# EAGLE design MM-H_rev1 (EAGLE 8.7.1)
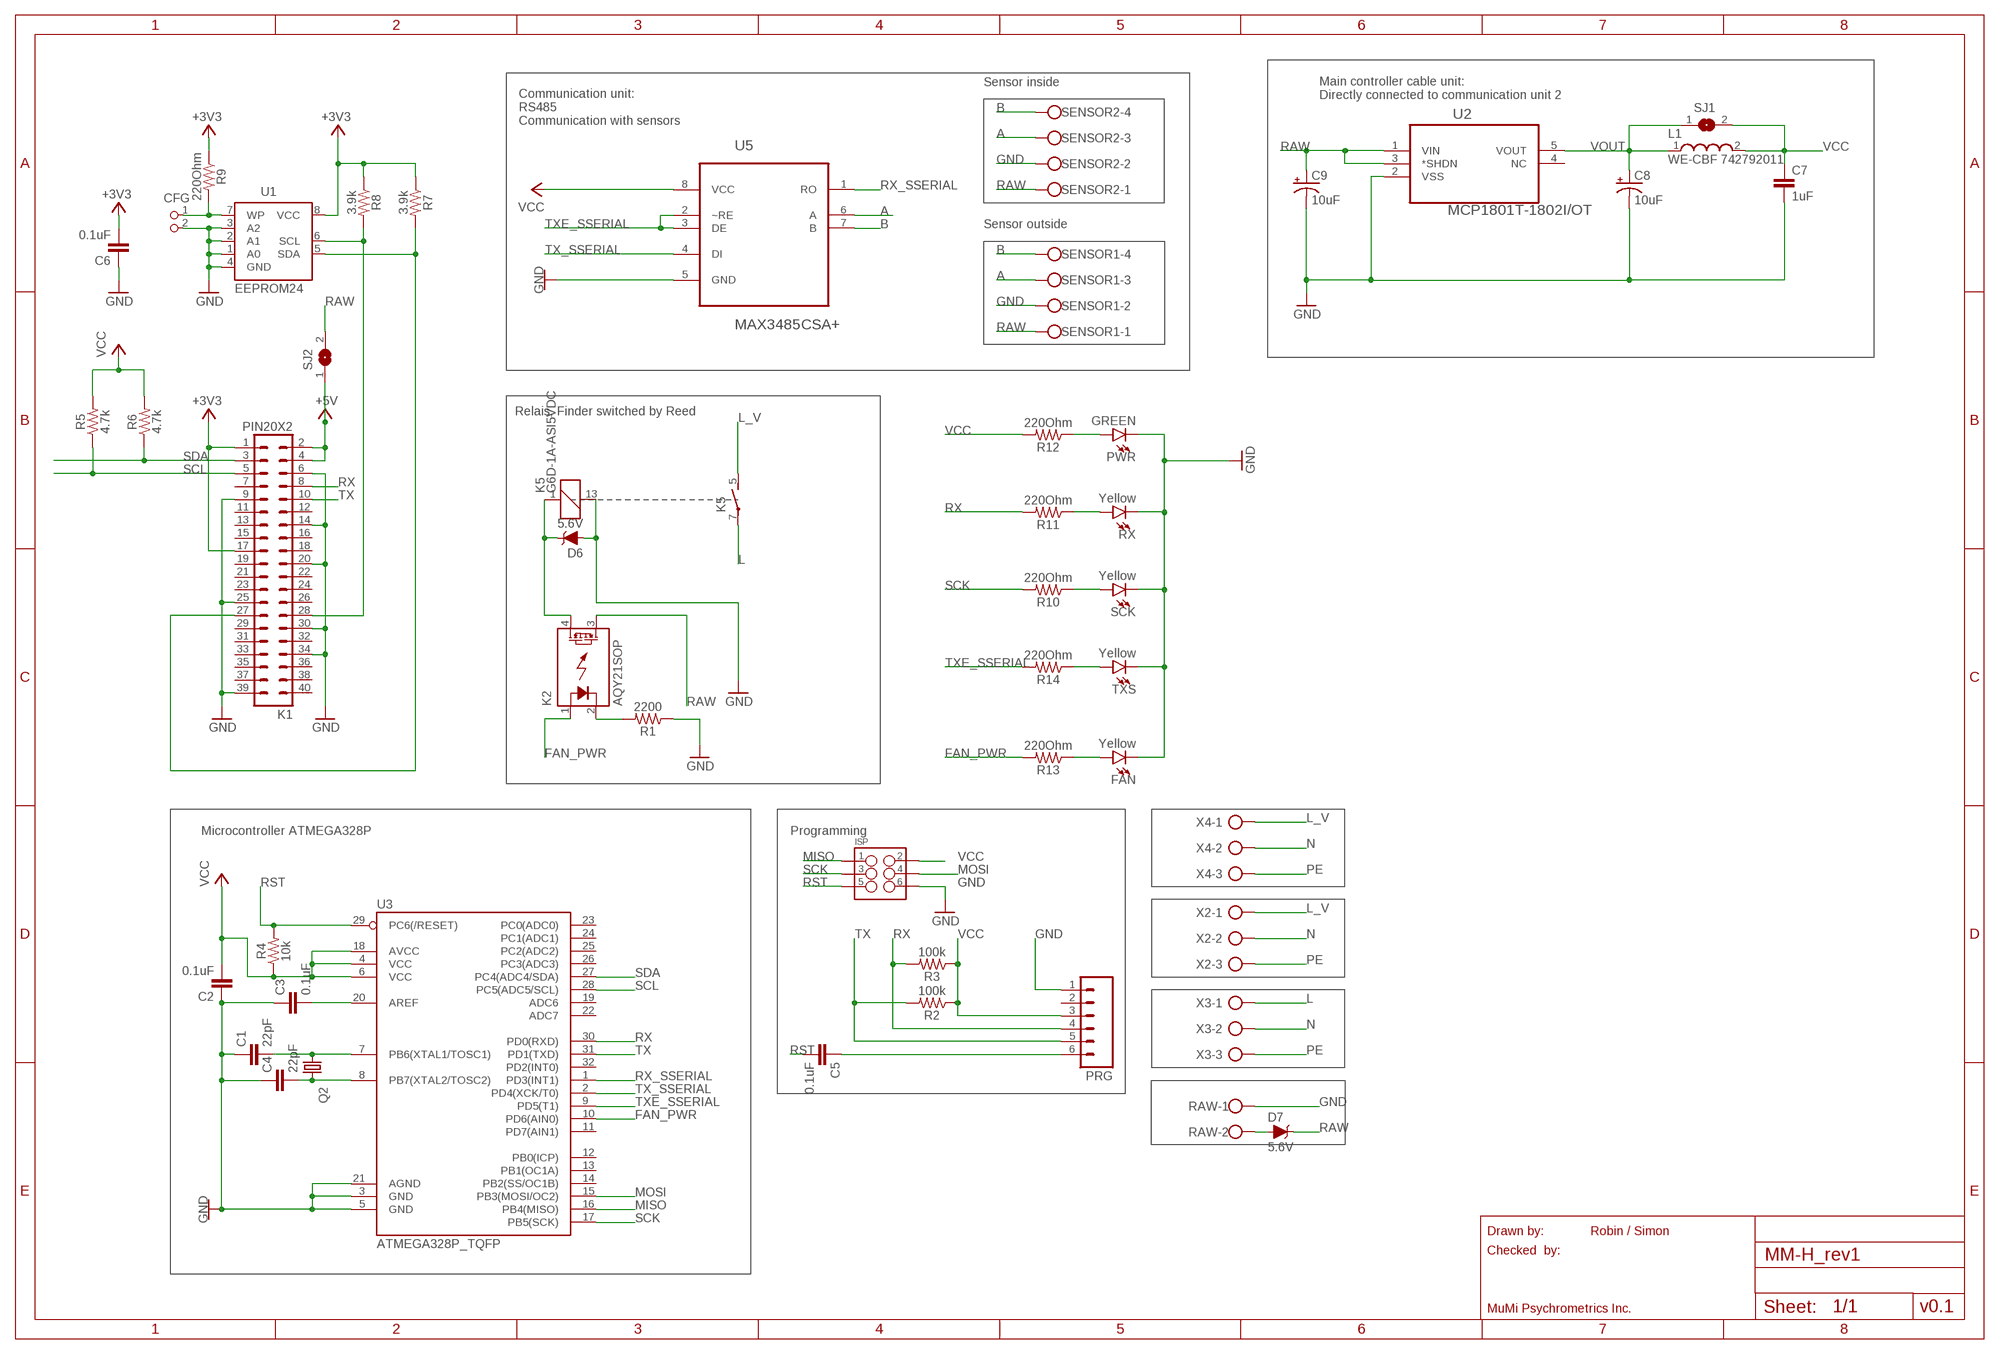
[diagram p0: schematic, sheet 1]

## Parts
C1  22pF  0.1UF-0402-16V-10%  [0402]
C2  0.1uF  0.1UF-0402-16V-10%  [0402]
C3  0.1uF  0.1UF-0402-16V-10%  [0402]
C4  22pF  0.1UF-0402-16V-10%  [0402]
C5  0.1uF  0.1UF-0402-16V-10%  [0402]
C6  0.1uF  0.1UF-0402-16V-10%  [0402]
C7  1uF  0.1UF-0402-16V-10%  [0402]
C8  10uF  CAP_POL1206  [EIA3216]
C9  10uF  CAP_POL1206  [EIA3216]
CFG  PIN2_100  [PIN_W_2]
D6  5.6V  DIODE-ZENER-MMSZ5232BS  [SOD-323]
D7  5.6V  DIODE-ZENER-MMSZ5232BS  [SOD-323]
FAN  Yellow  LED-YELLOW0603-SMART  [LED-0603]
ISP  M03X2POGO_PINS  [2X3_POGO]
K1  PIN20X2  [PIN_20X2]
K2  AQY21SOP  [SOP04]
K5  G6D-1A-ASI5VDC  [G6D]
L1  WE-CBF 742792011  WE-CBF_0805(WB/HS)  [WE-CBF_0805(W=3.0)]
PRG  M06SILK_FEMALE_PTH  [1X06]
PWR  GREEN  LED-GREEN0603  [LED-0603]
Q2  KX-K  [11.4X4.5]
R1  2200  RESISTOR0402  [0402]
R2  100k  RESISTOR0402  [0402]
R3  100k  RESISTOR0402  [0402]
R4  10k  RESISTOR0402  [0402]
R5  4.7k  RESISTOR0402  [0402]
R6  4.7k  RESISTOR0402  [0402]
R7  3.9k  RESISTOR0402  [0402]
R8  3.9k  RESISTOR0402  [0402]
R9  220Ohm  RESISTOR0402  [0402]
R10  220Ohm  RESISTOR0402  [0402]
R11  220Ohm  RESISTOR0402  [0402]
R12  220Ohm  RESISTOR0402  [0402]
R13  220Ohm  RESISTOR0402  [0402]
R14  220Ohm  RESISTOR0402  [0402]
RAW  W237-102  [W237-102]
RX  Yellow  LED-YELLOW0603-SMART  [LED-0603]
SCK  Yellow  LED-YELLOW0603-SMART  [LED-0603]
SENSOR1  W237-4  [W237-4]
SENSOR2  W237-4  [W237-4]
SJ1  SJ  [SJ]
SJ2  SJ  [SJ]
TXS  Yellow  LED-YELLOW0603-SMART  [LED-0603]
U1  EEPROM24  [SOIC8]
U2  MCP1801T-1802I/OT  [SOT95P270X145-5N]
U3  ATMEGA328P_TQFP  [TQFP32-08]
U5  MAX3485CSA+  [SOIC127P600X175-8N]
X2  AK500/3  [AK500/3]
X3  AK500/3  [AK500/3]
X4  AK500/3  [AK500/3]

## Nets
+3V3: C6.2 K1.1 K1.17 R7.1 R8.1 R9.1 U1.8(VCC)
+5V: K1.2 K1.4 SJ2.1
A: SENSOR1.3 SENSOR2.3 U5.6(A)
B: SENSOR1.4 SENSOR2.4 U5.7(B)
FAN_PWR: K2.1(A) R13.2 U3.10(PD6(AIN0))
GND: C1.1 C2.1 C3.1 C4.1 C6.1 C7.2 C8.C(-) C9.C(-) CFG.2 D6.A FAN.C ISP.P$6 K1.6 K1.9 K1.14 K1.20 K1.25 K1.30 K1.34 K1.39 K5.13 PRG.1 PWR.C R1.1 RAW.1 RX.C SCK.C SENSOR1.2 SENSOR2.2 TXS.C U1.1(A0) U1.2(A1) U1.3(A2) U1.4(GND) U2.2(VSS) U3.3(GND) U3.5(GND) U3.21(AGND) U5.5(GND)
L: K5.7(2:P) X3.1
L_V: K5.5(2:S) X2.1 X4.1
MISO: ISP.P$1 U3.16(PB4(MISO))
MOSI: ISP.P$4 U3.15(PB3(MOSI/OC2))
N: X2.2 X3.2 X4.2
N$1: K1.28 R8.2 U1.6(SCL)
N$2: K1.27 R7.2 U1.5(SDA)
N$3: CFG.1 R9.2 U1.7(WP)
N$4: K2.2(K) R1.2
N$5: C5.1 PRG.6
N$6: R11.1 RX.A
N$7: D7.A RAW.2
N$11: D6.C K2.4(DS1) K5.1
N$12: C3.2 U3.20(AREF)
N$13: PWR.A R12.1
N$14: R10.1 SCK.A
N$15: R14.1 TXS.A
N$16: FAN.A R13.1
N$17: C1.2 Q2.1 U3.7(PB6(XTAL1/TOSC1))
N$18: C4.2 Q2.2 U3.8(PB7(XTAL2/TOSC2))
PE: X2.3 X3.3 X4.3
RAW: C9.A(+) D7.C K2.3(DS2) SENSOR1.1 SENSOR2.1 SJ2.2 U2.1(VIN) U2.3(*SHDN)
RST: C5.2 ISP.P$5 R4.2 U3.29(PC6(/RESET))
RX: K1.8 PRG.4 R3.2 R11.2 U3.30(PD0(RXD))
RX_SSERIAL: U3.1(PD3(INT1)) U5.1(RO)
SCK: ISP.P$3 R10.2 U3.17(PB5(SCK))
SCL: K1.5 R5.1 U3.28(PC5(ADC5/SCL))
SDA: K1.3 R6.1 U3.27(PC4(ADC4/SDA))
TX: K1.10 PRG.5 R2.2 U3.31(PD1(TXD))
TX_SSERIAL: U3.2(PD4(XCK/T0)) U5.4(DI)
TXE_SSERIAL: R14.2 U3.9(PD5(T1)) U5.2(~RE) U5.3(DE)
VCC: C2.2 C7.1 ISP.P$2 L1.2 PRG.3 R2.1 R3.1 R4.1 R5.2 R6.2 R12.2 SJ1.2 U3.4(VCC) U3.6(VCC) U3.18(AVCC) U5.8(VCC)
VOUT: C8.A(+) L1.1 SJ1.1 U2.5(VOUT)
Unconnected: K1.7 K1.11 K1.12 K1.13 K1.15 K1.16 K1.18 K1.19 K1.21 K1.22 K1.23 K1.24 K1.26 K1.29 K1.31 K1.32 K1.33 K1.35 K1.36 K1.37 K1.38 K1.40 PRG.2 U2.4(NC) U3.11(PD7(AIN1)) U3.12(PB0(ICP)) U3.13(PB1(OC1A)) U3.14(PB2(SS/OC1B)) U3.19(ADC6) U3.22(ADC7) U3.23(PC0(ADC0)) U3.24(PC1(ADC1)) U3.25(PC2(ADC2)) U3.26(PC3(ADC3)) U3.32(PD2(INT0))

## Notes on the sheet
- Sensor inside
- Main controller cable unit:
  Directly connected to communication unit 2
- Communication unit:
  RS485
  Communication with sensors
- Sensor outside
- Relais, Finder switched by Reed
- Microcontroller ATMEGA328P | Programming
- Drawn by: | Robin / Simon
- Checked  by:
- MuMi Psychrometrics Inc. | v0.1

## Library data of the parts
C1 C4 C7 = SparkFun-Capacitors:0.1UF: 0.1µF ceramic capacitors A capacitor is a passive two-terminal electrical component used to store electrical energy temporarily in an electric field.; PROD_ID: CAP-12416; VALUE: 0.1uF
C2 C3 C5 C6 = SparkFun-Capacitors:0.1UF: 0.1µF ceramic capacitors A capacitor is a passive two-terminal electrical component used to store electrical energy temporarily in an electric field.; PROD_ID: CAP-12416
C8 C9 = SparkFun-Passives:CAP_POL: Capacitor Polarized These are standard SMD and PTH capacitors. Normally 10uF, 47uF, and 100uF in electrolytic and tantalum varieties. Always verify the external diameter of the through hole cap, it varies with capacity, voltage, and manufacturer. The EIA devices should be standard.
CFG = FLYFISH:PIN2
D6 D7 = SparkFun-DiscreteSemi:DIODE-ZENER: Zener Diode A Zener diode allows current to flow from its anode to its cathode like a normal semiconductor diode, but it also permits current to flow in the reverse direction when its "Zener voltage" is reached. - WIkipedia; PROD_ID: DIO-12442
FAN RX SCK TXS = SparkFun-LED:LED-YELLOW: Yellow SMD LED Used in manufacturing several products at SparkFun. Packages: 0603 - SMD 0603 package[Product Link] <http://www.kingbrightusa.com/product.asp?catalog_name=LED&product_id=APT1608SYCK> 0603 -SMART - SMART SMD 0603 package (more efficient/more expensive) [Product Link] <http://www.osram-os.com/osram_os/en/products/product-catalog/led-light-emitting-diodes/smartled-0603/ly-l29k/index.jsp> LilyPad - SMD1206 package[Product Datasheet] <https://www.sparkfun.com/datasheets/DevTools/LilyPad/Q150YUS4.pdf> SparkFun Products: Blynk Board <https://www.sparkfun.com/products/13794> IOIO-OTG <https://www.sparkfun.com/products/13613> XBee Explorer Serial <https://www.sparkfun.com/products/13225>; PROD_ID: DIO-11230
ISP = SparkFun-Connectors:M03X2: 2x3 .1" header. Shrouded, with keying- CONN-10681 SMT- CONN-11415 Pogo pins- HW-11044; PROD_ID: HW-11044
K1 = FLYFISH:PIN20X2
K2 = relay:AQY*: PhotoMOS Relay NAiS Source: http://www.panasonic-electric-works.com/catalogues/downloads/photomos/ds_x615_en_aqz10_20.pdf; OC_FARNELL: unknown; OC_NEWARK: unknown
K5 = relay:G6D?*: OMRON Slim, Miniature PCB Relay 17.5 × 6.5 × 12.5 mm with Socked Source: http://ecb.omron.com.sg/pdf/relay/power/G6D.pdf; OC_FARNELL: 9812660; OC_NEWARK: unknown
L1 = Wurth_Elektronik_Passive_rev15f:WE-CBF: WE-CBF SMD EMI Suppression Ferrite Bead Characteristics Reliable Ni-Sn electrodes High rated current up to 6 A Operating temperature: –55 ºC to +125 ºC Applications Perfect as data lined filter and for uncoupling of distribution voltage Variant abbreviation WB means WIDE BAND HS means HIGH SPEED HC means HIGH CURRENT <http://katalog.we-online.de/media/images/eisos/FeCBF_pf2.jpg> Details see: http://katalog.we-online.de/en/pbs/WE-CBF Updated on 2014-06-19 2014 (C) Wurth Elektronik
PRG = SparkFun-Connectors:M06: Header 6 Standard 6-pin 0.1" header. Use with straight break away headers (SKU : PRT-00116), right angle break away headers (PRT-00553), swiss pins (PRT-00743), machine pins (PRT-00117), and female headers (PRT-00115). Molex polarized connector foot print use with SKU : PRT-08094 with associated crimp pins and housings. NOTES ON THE VARIANTS LOCK and LOCK_LONGPADS... This footprint was designed to help hold the alignment of a through-hole component (i.e. 6-pin header) while soldering it into place. You may notice that each hole has been shifted either up or down by 0.005 of an inch from it's more standard position (which is a perfectly straight line). This slight alteration caused the pins (the squares in the middle) to touch the edges of the holes. Because they are alternating, it causes a "brace" to hold the component in place. 0.005 has proven to be the perfect amount of "off-center" position when using our standard breakaway headers. Although looks a little odd when you look at the bare footprint, once you have a header in there, the alteration is very hard to notice. Also,if you push a header all the way into place, it is covered up entirely on the bottom side. This idea of altering the position of holes to aid alignment will be further integrated into the Sparkfun Library for other footprints. It can help hold any component with 3 or more connection pins.; PROD_ID: CONN-08437
PWR = SparkFun-LED:LED-GREEN: Green SMD LED Used in manufacturing of various products at SparkFun Packages: 0603 - SMD 0603 package [Product Link] <http://www.futureelectronics.com/en/technologies/semiconductors/optoelectronics/leds/Pages/9894312-LTST-C190GKT.aspx?CrossPart=HSMG-C190&IM=0> LilyPad 1206 - SMD1206 LilyPad package [Product Link] <http://www.futureelectronics.com/en/Technologies/Product.aspx?ProductID=IN150NGHARVATEKCORPORATION2049943&IM=0> 1206 - SMD1206 package [Product Link] <http://www.futureelectronics.com/en/technologies/semiconductors/optoelectronics/leds/Pages/8315665-LTST-C150KGKT.aspx?IM=0> 1206 Bottom Mount -SMD 1206 Bottom Mount [Product Link] <http://www.digikey.com/product-detail/en/lite-on-inc/LTST-C230KGKT/160-1456-1-ND/386854> SparkFun Products: Pro Mini 328 -5V <https://www.sparkfun.com/products/821> RedBoard <https://www.sparkfun.com/products/12757> MP3 Trigger <https://www.sparkfun.com/products/13720> Makey Makey <https://www.sparkfun.com/products/11076>; PROD_ID: DIO-00821
Q2 = crystal-geyer_V1_0:KX: Quartz Crystals (MHz) SMD: KX - Serie Model Size l/w/h [mm] Frequency Range Frequency Stability Temp. Range [°C] Load Capacitance AECQ 200 availabel Datasheet KX-4 KX-5 KX-6 KX-7 KX-9A KX-9B KX-12A KX-12B KX-13 KX-20 KX-K KX-KS 1.6/1.2/0.3 2.0/1.6/0.45 2.5/2.0/0.55 3.2/2.5/0.8 5.0/3.2/1.0 5.0/3.2/1.1 6.0/3.5/1.1 6.0/3.5/1.0 7.0/5.0 /1.3 11.6/5.5/1.6 12.3/4.5/4.2 12.3/4.5/3.2 24.0 ~ 80.0 MHz 16.0 ~ 80.0 MHz 12.0 ~ 80.0 MHz 8.0 ~ 60.0 MHz 7,68 ~ 300,0 MHz 8,0 ~ 50,0 MHz 8,0 ~ 150,0 MHz 8,0 ~ 50,0 MHz 6,0 ~ 160,0 MHz 3,579 ~ 25,0 MHz 3,579 ~ 70,0 MHz 3,579 ~ 70,0 MHz ±10 … ±50ppm ±10 … ±50ppm ±10 … ±50ppm ±10 … ±50ppm ±10 … ±50ppm ±10 … ±50ppm ±10 … ±50ppm ±10 … ±50ppm ±10 … ±50ppm ±50ppm ±10 … ±50ppm ±10 … ±50ppm (*) -40°C …+85°C (*) -40°C …+125°C (*) -40°C …+125°C (*) -40°C …+125°C (*) -40°C …+105°C (*) -40°C …+105°C (*) -40°C …+125°C (*) -40°C …+105°C (*) -40°C …+105°C (*) -40°C …+105°C (*) -40°C …+85°C (*) -40°C …+85°C 8, 8…16 8, 8…16 10, 8…16 12, 7…20 16, 10…20 16, 10…20 16, 10…20 16, 12…20 16, 12…20 16, 12…20 16, 12…30 16, 12…30 - yes yes yes - - - - - - - - KX-4.pdf <http://www.geyer-electronic.de/uploads/tx_userartikelfrequenz/GEYER-KX-4.pdf> KX-5.pdf <http://www.geyer-electronic.de/uploads/tx_userartikelfrequenz/GEYER-KX-5.pdf> KX-6.pdf <http://www.geyer-electronic.de/uploads/tx_userartikelfrequenz/GEYER-KX-6.pdf> KX-7.pdf <http://www.geyer-electronic.de/uploads/tx_userartikelfrequenz/GEYER-KX-7.pdf> KX-9A.pdf <http://www.geyer-electronic.de/uploads/tx_userartikelfrequenz/GEYER-KX-9A.pdf> KX-9B.pdf <http://www.geyer-electronic.de/uploads/tx_userartikelfrequenz/GEYER-KX-9B.pdf> KX-12A.pdf <http://www.geyer-electronic.de/uploads/tx_userartikelfrequenz/GEYER-KX-12A.pdf> KX-12B.pdf <http://www.geyer-electronic.de/uploads/tx_userartikelfrequenz/GEYER-KX-12B.pdf> KX-13.pdf <http://www.geyer-electronic.de/uploads/tx_userartikelfrequenz/GEYER-KX-13.pdf> KX-20.pdf <http://www.geyer-electronic.de/uploads/tx_userartikelfrequenz/GEYER-KX-20.pdf> KX-K.pdf <http://www.geyer-electronic.de/uploads/tx_userartikelfrequenz/GEYER-KX-K.pdf> KX-KS.pdf <http://www.geyer-electronic.de/uploads/tx_userartikelfrequenz/GEYER-KX-KS.pdf> <http://www.geyer-electronic.de/fileadmin/template/img/logo-geyer-electronic.png> Details see: http://www.geyer-electronic.de/Frequenz-Produkte.9.0.html Created 2016-06-07, Hans Locher 2016 (C) Geyer Quartz Technology KX4,KX5,KX6,KX7,KX9A,KX9B,KX12A,KX12B,KX13,KX20,KXK,KXKS;1612;2016;2520;3225;5032;6035;7050;11655;12345;1,6x1,2;2,0x1,6;2,5x2,0;3,2x2,5;5,0x3,2;6,0x3,5;7,0x5,0;11,6x5,5;12,3x4,5;12,3x4,5;1.6x1.2;2.0x1.6;2.5x2.0;3.2x2.5;5.0x3.2;6.0x3.5;7.0x5.0;11.6x5.5;12.3x4.5;12.3x4.5;
R1-R14 = SparkFun-Resistors:RESISTOR: Generic Resistor Package
RAW = con-wago-500:W237-102: WAGO SCREW CLAMP; MPN: 237-102; OC_FARNELL: unknown; OC_NEWARK: 70K9898
SENSOR1 SENSOR2 = con-wago-500:W237-4: WAGO SCREW CLAMP; OC_FARNELL: unknown; OC_NEWARK: unknown
SJ1 SJ2 = jumper:SJ: SMD solder JUMPER
U1 = FLYFISH:EEPROM24
U2 = Microchip_By_element14_Batch_1:MCP1801T-1802I/OT: IC, LDO, 1.8V, 150MA, SOT-23-5; MPN: MCP1801T-1802I/OT; OC_FARNELL: 1578368; OC_NEWARK: 54M4827; PACKAGE: SOT-23-5; SUPPLIER: MICROCHIP
U3 = SparkFun-IC-Microcontroller:ATMEGA328P_TQFP: Popular 328P in QFP Storefront component: ATmega328 - TQFP <https://www.sparkfun.com/products/13448> (COM-13448) Datasheet <http://www.sparkfun.com/datasheets/Components/SMD/ATMega328.pdf> SparkFun Products SparkFun RedBoard - Programmed with Arduino <https://www.sparkfun.com/products/12757> (DEV-12757) Arduino Pro Mini 328 - 5V/16MHz <https://www.sparkfun.com/products/11113> (DEV-11113) Arduino Pro Mini 328 - 3.3V/8MHz <https://www.sparkfun.com/products/11114> (DEV-11114) SparkFun OpenLog <https://www.sparkfun.com/products/13712> (DEV-13712) SparkFun MicroView - OLED Arduino Module <https://www.sparkfun.com/products/12923> (DEV-12923) SparkFun Digital Sandbox <https://www.sparkfun.com/products/12651> (DEV-12651) SparkFun PicoBoard <https://www.sparkfun.com/products/11888> (WIG-11888) Arduino Fio <https://www.sparkfun.com/products/10116> (DEV-10116) LilyPad Arduino 328 Main Board <https://www.sparkfun.com/products/13342> (DEV-13342) SparkFun RedStick <https://www.sparkfun.com/products/13741> (DEV-13741) LilyPad MP3 <https://www.sparkfun.com/products/11013> (DEV-11013) LilyPad Arduino SimpleSnap <https://www.sparkfun.com/products/10941> (DEV-10941) SparkFun Stepoko <https://www.sparkfun.com/products/13899> (ROB-13899) SparkFun Geiger Counter <https://www.sparkfun.com/products/11345> (SEN-11345) SparkFun EL Sequencer <https://www.sparkfun.com/products/12781> (COM-12781) Arduino Pro 328 - 5V/16MHz <https://www.sparkfun.com/products/10915> (DEV-10915) CryptoCape <https://www.sparkfun.com/products/12773> (DEV-12773) SparkFun IR Thermometer Evaluation Board - MLX90614 <https://www.sparkfun.com/products/10740> (SEN-10740) SparkFun RedBot Mainboard <https://www.sparkfun.com/products/12097> (ROB-12097) Arduino Pro 328 - 3.3V/8MHz <https://www.sparkfun.com/products/10914> (DEV-10914) SparkFun Block for Intel® Edison - Arduino <https://www.sparkfun.com/products/13036> (DEV-13036) SparkFun Simon Says - Surface Mount Soldering Kit <https://www.sparkfun.com/products/10935> (KIT-10935) SparkFun 7-Segment Serial Display - Red <https://www.sparkfun.com/products/11441> (COM-11441) SparkFun 7-Segment Serial Display - White <https://www.sparkfun.com/products/11629> (COM-11629) SparkFun 7-Segment Serial Display - Yellow <https://www.sparkfun.com/products/11443> (COM-11443) SparkFun 7-Segment Serial Display - Kelly Green <https://www.sparkfun.com/products/11440> (COM-11440) SparkFun 7-Segment Serial Display - Blue <https://www.sparkfun.com/products/11442> (COM-11442) SparkFun OpenSegment Serial Display - 20mm (Blue) <https://www.sparkfun.com/products/11647> (COM-11647) SparkFun OpenSegment Serial Display - 20mm (Green) <https://www.sparkfun.com/products/11646> (COM-11646) SparkFun OpenSegment Serial Display - 20mm (White) <https://www.sparkfun.com/products/11648> (COM-11648) SparkFun OpenSegment Serial Display - 20mm (Red) <https://www.sparkfun.com/products/11644> (COM-11644) SparkFun OpenSegment Serial Display - 20mm (Yellow) <https://www.sparkfun.com/products/11645> (COM-11645) SparkFun OpenSegment Shield <https://www.sparkfun.com/products/13190> (DEV-13190); PROD_ID: IC-09069
U5 = Maxim_By_element14_Batch_1:MAX3485CSA+: 3.3V-Powered, 10Mbps and Slew-Rate-Limited True RS-485/RS-422 Transceivers; MPN: MAX3485CSA+; OC_FARNELL: 1379946; OC_NEWARK: 68K4659; PACKAGE: SOIC-8; SUPPLIER: Maxim
X2-X4 = Own:AK500/3: CONNECTOR; OC_FARNELL: unknown; OC_NEWARK: unknown

## Board
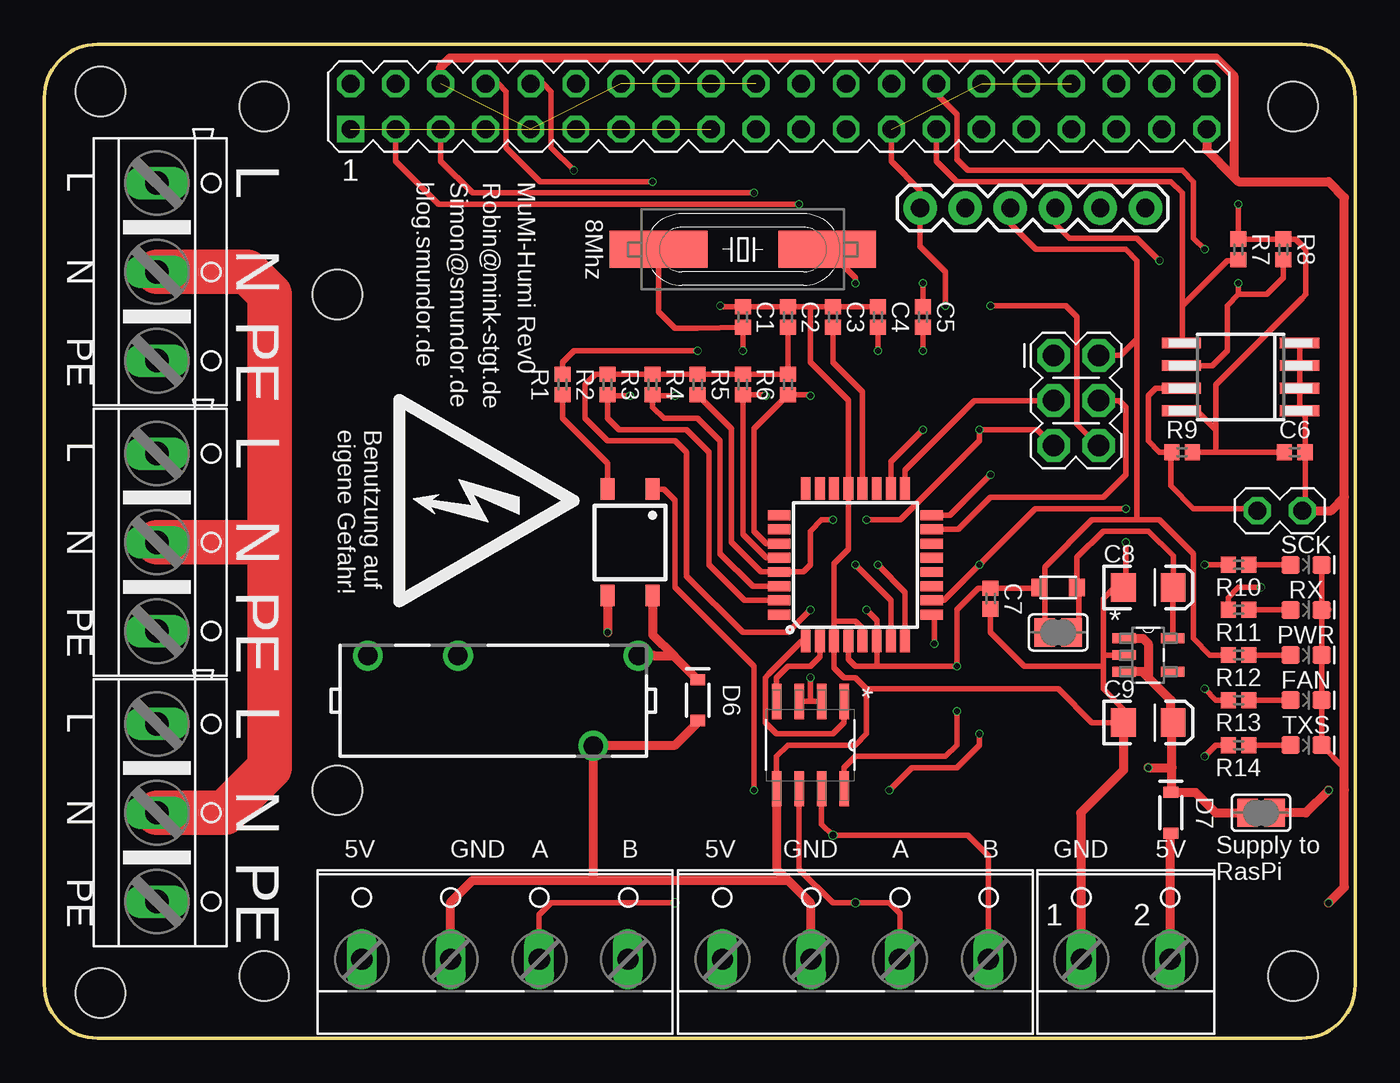
[diagram p1: board, top side]
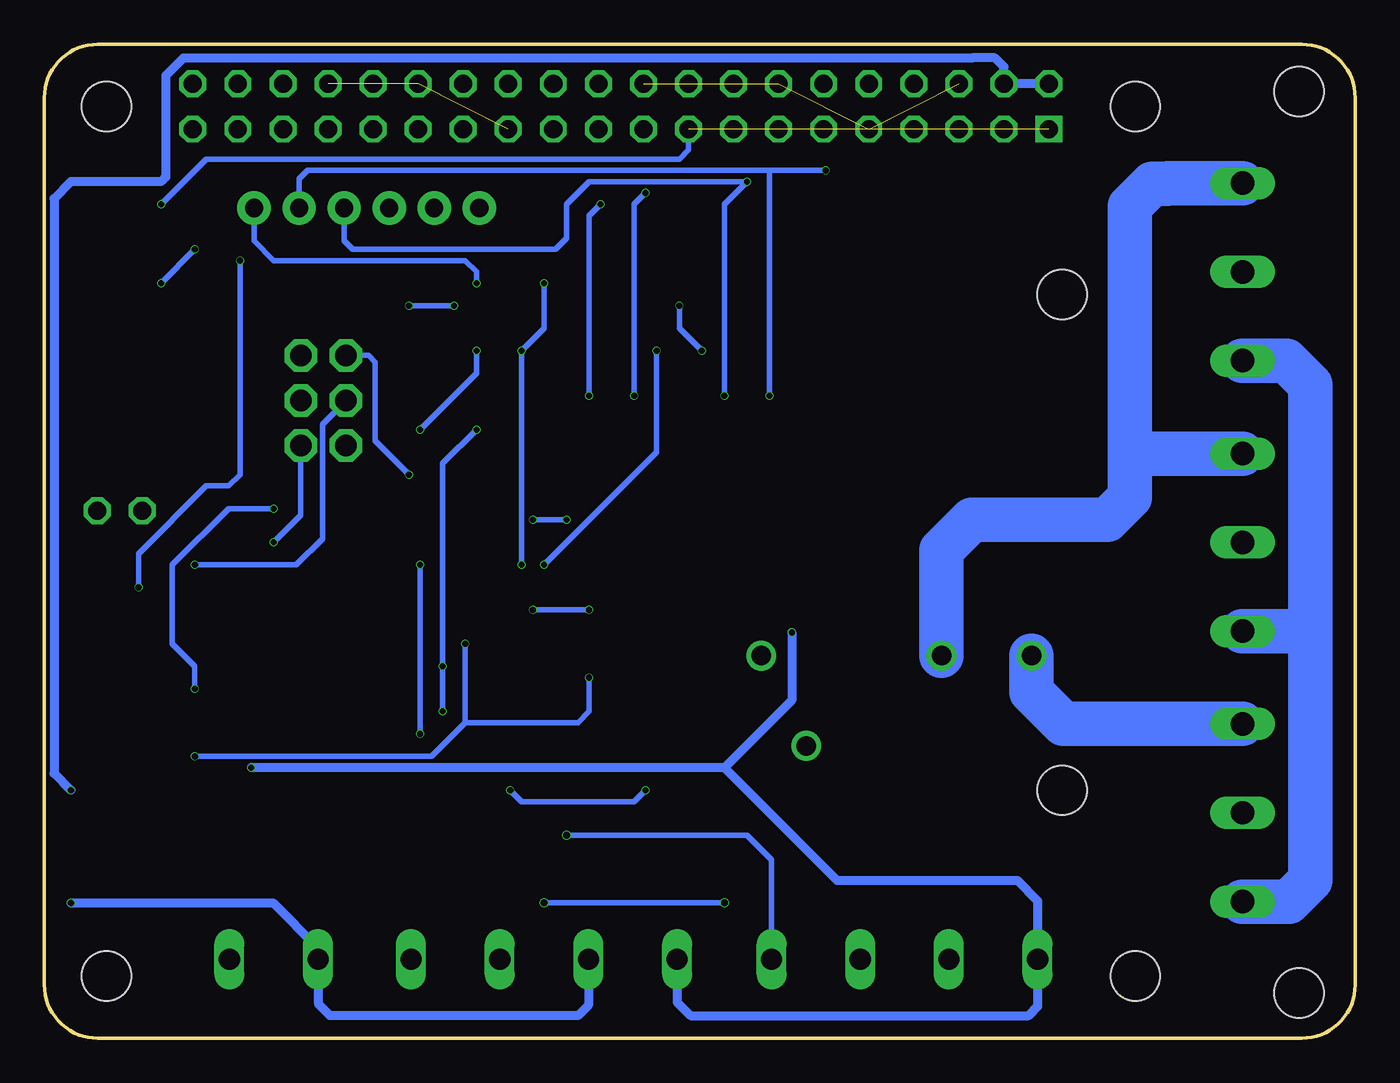
[diagram p2: board, bottom side, seen from below]

Size 73.89 x 56 mm. Coordinates in mm from the lower left corner, seen from the top.
Outline: 0,3 arc90 3,0 70.89,0 arc90 73.89,3 73.89,53 arc90 70.89,56 3,56 arc90 0,53 0,3
Copper layers (1*16): Top 0.035mm / dielectric 1.5mm / Bottom 0.035mm
Design rules "aisler_go_2layer": minimum track width 0.1mm, minimum drill 0.2mm, track to track 0.1mm, track to pad 0.1mm, pad to pad 0.1mm, via to via 0.1mm, smd to smd 0.1mm, copper to edge 0.2mm, drill to drill 0.21mm, minimum pad ring 0.25mm, minimum via ring 0.05mm, stop-mask expansion 0.01mm, vias tented up to drill 0mil, thermal gap 10mil
Holes 2.8 mm at 12.39,3.5 12.39,52.5 70.39,52.5 70.39,3.5 3.17,53.34 3.17,2.54 16.51,41.91 16.51,13.97
tRestrict: area 10.8,51 to 13.9,54; area 68.8,51 to 71.9,54; area 68.8,1.9 to 71.9,5; area 10.8,1.9 to 13.9,5
bRestrict: area 10.8,1.9 to 13.9,5; area 10.8,51 to 13.9,54; area 68.8,1.9 to 71.9,5; area 68.8,51 to 71.9,54

### Footprints (pad centres in the part's own frame; a part is rotated, then mirrored left to right if it is on the bottom)
0402 = smd 0.85 x 0.9: 1 -0.58,0; 2 0.58,0
EIA3216 = smd 1.4 x 1.6: A 1.4,0; C -1.4,0
PIN_W_2 = drill 1.016 octagon: 1 0,0; 2 0,-2.54
SOD-323 = smd 0.63 x 0.83: A 1.15,0; C -1.15,0
LED-0603 = smd 1 x 1: A -0.877,0; C 0.877,0
2X3_POGO = drill 1.2 pad 1.829 octagon: P$1 0,0; P$2 0,2.54; P$3 2.54,0; P$4 2.54,2.54; P$5 5.08,0; P$6 5.08,2.54
PIN_20X2 = drill 1.016 square: 1 -24.13,-1.27 | drill 1.016 octagon: 2 -24.13,1.27; 3 -21.59,-1.27; 4 -21.59,1.27; 5 -19.05,-1.27; 6 -19.05,1.27; 7 -16.51,-1.27; 8 -16.51,1.27; 9 -13.97,-1.27; 10 -13.97,1.27; 11 -11.43,-1.27; 12 -11.43,1.27; 13 -8.89,-1.27; 14 -8.89,1.27; 15 -6.35,-1.27; 16 -6.35,1.27; 17 -3.81,-1.27; 18 -3.81,1.27; 19 -1.27,-1.27; 20 -1.27,1.27; 21 1.27,-1.27; 22 1.27,1.27; 23 3.81,-1.27; 24 3.81,1.27; 25 6.35,-1.27; 26 6.35,1.27; 27 8.89,-1.27; 28 8.89,1.27; 29 11.43,-1.27; 30 11.43,1.27; 31 13.97,-1.27; 32 13.97,1.27; 33 16.51,-1.27; 34 16.51,1.27; 35 19.05,-1.27; 36 19.05,1.27; 37 21.59,-1.27; 38 21.59,1.27; 39 24.13,-1.27; 40 24.13,1.27
SOP04 = smd 0.8 x 1.2: 1 -1.27,-3; 2 1.27,-3; 3 1.27,3; 4 -1.27,3
G6D = drill 1.1 pad 1.676: 1 8.08,2.5; 5 -2.08,2.5; 7 -7.16,2.5; 13 5.54,-2.58
WE-CBF_0805(W=3.0) = smd 0.9 x 1: 1 -1.05,0; 2 1.05,0
1X06 = drill 1.016 pad 1.88: 1 0,0; 2 2.54,0; 3 5.08,0; 4 7.62,0; 5 10.16,0; 6 12.7,0
11.4X4.5 = smd 5.5 x 2.08: 1 -4.75,0; 2 4.75,0
W237-102 = drill 1.194 long: 1 -2.5,-1.27; 2 2.5,-1.27
W237-4 = drill 1.194 long: 1 -7.5,-1.27; 2 -2.5,-1.27; 3 2.5,-1.27; 4 7.5,-1.27
SJ = smd 1.168 x 1.6: 1 -0.762,0; 2 0.762,0
SOIC8 = smd 0.6 x 2.2: 1 -1.905,-3.33; 2 -0.635,-3.33; 3 0.635,-3.33; 4 1.905,-3.33; 5 1.905,3.33; 6 0.635,3.33; 7 -0.635,3.33; 8 -1.905,3.33
SOT95P270X145-5N = smd 1.321 x 0.559: 1 -1.372,0.94; 2 -1.372,0; 3 -1.372,-0.94; 4 1.372,-0.94; 5 1.372,0.94
TQFP32-08 = smd 1.27 x 0.559: 1 -4.293,2.8; 2 -4.293,2; 3 -4.293,1.2; 4 -4.293,0.4; 5 -4.293,-0.4; 6 -4.293,-1.2; 7 -4.293,-2; 8 -4.293,-2.8; 17 4.293,-2.8; 18 4.293,-2; 19 4.293,-1.2; 20 4.293,-0.4; 21 4.293,0.4; 22 4.293,1.2; 23 4.293,2; 24 4.293,2.8 | smd 0.559 x 1.27: 9 -2.8,-4.293; 10 -2,-4.293; 11 -1.2,-4.293; 12 -0.4,-4.293; 13 0.4,-4.293; 14 1.2,-4.293; 15 2,-4.293; 16 2.8,-4.293; 25 2.8,4.293; 26 2,4.293; 27 1.2,4.293; 28 0.4,4.293; 29 -0.4,4.293; 30 -1.2,4.293; 31 -2,4.293; 32 -2.8,4.293
SOIC127P600X175-8N = smd 1.981 x 0.533: 1 -2.464,1.905; 2 -2.464,0.635; 3 -2.464,-0.635; 4 -2.464,-1.905; 5 2.464,-1.905; 6 2.464,-0.635; 7 2.464,0.635; 8 2.464,1.905
AK500/3 = drill 1.321 long: 1 -5.004,0; 2 0,0; 3 5.004,0

### Placement (x,y rotation side)
C1  39.37,40.64 270 top
C2  41.91,40.64 270 top
C3  44.45,40.64 270 top
C4  46.99,40.64 270 top
C5  49.53,40.64 270 top
C6  70.48,33.02 180 top
C7  53.34,24.77 270 top
C8  62.23,25.4 0 top
C9  62.23,17.78 0 top
CFG  68.38,29.73 90 top
D6  36.83,19.05 270 top
D7  63.5,12.7 270 top
FAN  71.12,19.05 0 top
ISP  56.89,38.47 270 top
K1  41.39,52.5 0 top
K2  33.02,27.94 180 top
K5  25.4,19.05 0 top
L1  57.15,25.4 180 top
PRG  49.37,46.78 0 top
PWR  71.12,21.59 0 top
Q2  39.37,44.45 0 top
R1  29.21,36.83 270 top
R2  31.75,36.83 270 top
R3  34.29,36.83 270 top
R4  36.83,36.83 270 top
R5  39.37,36.83 90 top
R6  41.91,36.83 90 top
R7  67.31,44.45 270 top
R8  69.85,44.45 270 top
R9  64.14,33.02 180 top
R10  67.31,26.67 180 top
R11  67.31,24.13 180 top
R12  67.31,21.59 180 top
R13  67.31,19.05 180 top
R14  67.31,16.51 180 top
RAW  60.96,5.71 0 top
RX  71.12,24.13 0 top
SCK  71.12,26.67 0 top
SENSOR1  25.4,5.71 0 top
SENSOR2  45.72,5.71 0 top
SJ1  57.15,22.86 180 top
SJ2  68.58,12.7 180 top
TXS  71.12,16.51 0 top
U1  67.42,37.26 90 top
U2  62.23,21.59 0 top
U3  45.72,26.67 90 top
U5  43.18,16.51 270 top
X2  6.35,27.94 270 top
X3  6.35,12.7 270 top
X4  6.35,43.18 270 top

### Tracks (layer width: path | path; a pad name or v marks a point on that pad's centre or on a via)
+3V3  (via drill 0.35)  (1 unrouted)
  Top 0.3: U1.8 64.97,35.35 66.04,34.29 | 66.04,34.29 66.04,36.83 70.92,41.7 71.12,41.91 71.12,44.45 70.54,45.03 R8.1 R7.1 v67.31,46.99 | C6.2 66.04,33.02 | 66.04,33.02 R9.1 | 66.04,34.29 66.04,33.02
  Bottom 0.3: K1.17 37.58,50.05 38.1,49.53 64.77,49.53 v67.31,46.99
+5V  (via drill 0.35)
  Top 0.5: v72.39,13.97 71.12,12.7 SJ2.1
  Bottom 0.3: K1.4 20.11,53.77
  Bottom 0.5: K1.2 K1.4 19.8,54.73 20.32,55.24 21.59,55.24 66.04,55.24 67.04,54.24 67.04,48.53 67.31,48.26 72.39,48.26 73.34,47.31 73.34,14.92 v72.39,13.97
A  (via drill 0.4)
  Top 0.3: v35.56,7.62 28.57,7.62 27.9,6.95 SENSOR1.3 | U5.6 42.55,9.53 44.45,7.62 v45.72,7.62 47.62,7.62 48.22,7.03 SENSOR2.3
  Bottom 0.3: v35.56,7.62 v45.72,7.62
B  (via drill 0.4)
  Top 0.3: U5.7 43.81,12.06 v44.45,11.43 52.07,11.43 53.22,10.28 SENSOR2.4
  Bottom 0.3: v44.45,11.43 34.29,11.43 32.9,10.04 SENSOR1.4
FAN_PWR  (via drill 0.35)
  Top 0.3: U3.10 50.7,24.67 v52.7,26.67 54.93,28.89 55.88,29.84 | 55.88,29.84 | v47.62,13.97 48.9,15.24 51.44,15.24 52.7,16.51 v52.7,17.14 | R13.2 66.04,19.05 v65.41,19.68 | K2.1 34.92,30.94 35.56,30.3 35.56,25.4 40.01,20.95 v40.01,13.97 | v60.96,29.84 55.88,29.84
  Bottom 0.3: v65.41,19.68 65.41,20.95 66.67,22.23 66.67,24.13 66.67,26.67 63.5,29.84 v60.96,29.84 | v40.01,13.97 40.64,13.34 46.99,13.34 v47.62,13.97 | v52.7,17.14 v52.7,26.67
GND  (via drill 0.35)  (5 unrouted)
  Top 0.3: 44.52,22.93 U3.3 | 44.52,23.5 45.72,23.5 46.12,23.09 U3.5 | U5.5 41.27,15.88 41.91,16.51 45.72,16.51 46.35,17.14 46.35,19.68 | 70.97,29.78 CFG.2 71.06,29.88 C6.1 71.06,35.05 U1.1 | 70.97,35.15 U1.1 | U1.1 U1.2 U1.3 U1.4 | SCK.C 72,24.52 72.39,24.13 RX.C PWR.C FAN.C TXS.C 73.29,15.22 73.29,13.97 | 59.69,20.95 59.69,21.59 | 59.69,21.59 59.69,24.77 60.33,25.4 C8.C 60.96,25.53 v60.96,27.94 | U2.2 59.69,21.59 | C7.2 53.34,22.86 55.24,20.95 59.69,20.95 | 59.69,20.95 59.69,19.68 60.83,18.55 C9.C 59.05,17.78 57.15,19.68 46.35,19.68 | U3.3 44.52,20.89 45.09,20.32 45.72,20.32 46.35,19.68 | 43.18,41.22 C2.1 C1.1 38.16,41.22 v38.1,41.27 | 43.18,41.22 C3.1 C4.1 | 43.18,41.22 43.18,38.1 45.32,35.96 U3.21 45.32,27.54 44.52,26.74 44.52,23.5 | K1.25 47.74,49.41 49.37,47.78 PRG.1 49.37,44.61 50.8,43.18 v50.8,41.27 | ISP.P$6 58.21,34.61 58.21,40.64 57.58,41.27 v53.34,41.27 | U3.3 44.52,23.5 | R1.1 29.21,38.1 29.84,38.73 v36.83,38.73
  Top 0.5: K1.39 65.52,50.05 66.99,48.58 | 66.99,48.58 67.31,48.26 72.39,48.26 73.29,47.36 73.29,30.48 | 73.29,30.48 73.29,13.97 73.29,8.52 v72.39,7.62 | CFG.2 72.54,29.73 73.29,30.48 | D6.A 36.83,17.78 35.56,16.51 30.98,16.51 K5.13 30.94,9.06 31.11,8.89 | 41.91,8.89 43.18,7.62 43.18,4.41 SENSOR2.2 | 31.11,8.89 24.13,8.89 22.9,7.66 SENSOR1.2 | 31.11,8.89 41.91,8.89 | U5.5 41.27,9.53 41.91,8.89 | C9.C 60.83,15.11 58.42,12.7 58.42,4.41 RAW.1 | K1.6 22.34,54.73 22.86,55.24 66.04,55.24 67.04,54.24 67.04,48.62 66.99,48.58
  Bottom 0.3: ISP.P$6 59.43,29.47 v60.96,27.94 | v50.8,41.27 v53.34,41.27 | v36.83,38.73 38.1,40.01 v38.1,41.27
  Bottom 0.5: v72.39,7.62 61,7.62 58.46,5.08 RAW.1 | 58.42,3.81 58.42,1.91 57.78,1.27 43.81,1.27 43.22,1.86 SENSOR2.2
L
  Bottom 2.5: X3.1 16.43,17.7 18.24,19.51 K5.7
L_V
  Bottom 2.5: 12.7,33.02 12.7,46.88 11.43,48.15 10.59,48.15 10.55,48.18 X4.1 | X2.1 12.62,32.94 12.7,33.02 | K5.5 23.32,27.48 21.59,29.21 13.97,29.21 12.7,30.48 12.7,33.02
MISO  (via drill 0.35)
  Top 0.3: U3.16 51.06,29.47 v53.34,31.75
  Bottom 0.3: v53.34,31.75 55.24,33.66 55.24,38.1 55.62,38.47 ISP.P$1
MOSI
  Top 0.3: U3.15 51.53,28.67 53.34,30.48 59.69,30.48 60.96,31.75 60.96,35.56 60.59,35.93 ISP.P$4
N
  Top 2.5: X3.2 10.16,12.7 12.7,15.24 12.7,27.94 | 12.7,27.94 12.7,35.56 12.7,41.91 11.43,43.18 X4.2 | X2.2 12.7,27.94
N$1  (via drill 0.35)
  Top 0.3: U1.6 65.83,37.9 66.67,38.73 66.67,41.27 67.31,41.91 | K1.28 50.28,53.23 51.44,52.07 51.44,49.53 52.07,48.9 64.14,48.9 64.77,48.26 64.77,45.09 v65.41,44.45 | v67.31,42.55 67.31,41.91 | 67.31,41.91 68.9,41.91 69.85,42.86 R8.2
  Bottom 0.3: v65.41,44.45 v67.31,42.55
N$2
  Top 0.3: U1.5 64.14,39.2 64.14,40.64 64.14,41.27 | 64.14,41.27 64.14,47.62 63.5,48.26 51.44,48.26 50.28,49.41 K1.27 | R7.2 67.25,43.81 66.67,43.81 64.14,41.27
N$3
  Top 0.3: U1.7 62.66,36.62 62.23,36.2 62.23,33.66 62.87,33.02 R9.2 63.5,32.97 63.5,31.11 64.77,29.84 68.26,29.84 CFG.1
N$4
  Top 0.3: K2.2 31.75,32.38 29.21,34.92 R1.2
N$5  (via drill 0.35)
  Top 0.3: v49.53,42.55 C5.1
  Bottom 0.3: PRG.6 62.07,44.92 60.96,43.81 50.16,43.81 49.53,43.18 v49.53,42.55
N$6
  Top 0.3: R11.1 RX.A
N$7
  Top 0.5: RAW.2 63.46,11.51 D7.A
N$11
  Top 0.5: 34.29,21.59 33.52,21.59 K5.1 35.48,21.55 | K2.4 34.29,22.74 35.48,21.55 | D6.C 35.5,21.53 35.48,21.55
N$12
  Top 0.3: U3.20 46.12,36.43 44.45,38.1 C3.2
N$13
  Top 0.3: R12.1 PWR.A
N$14
  Top 0.3: R10.1 SCK.A
N$15
  Top 0.3: R14.1 TXS.A
N$16
  Top 0.3: R13.1 FAN.A
N$17  (via drill 0.35)
  Top 0.3: Q2.1 34.62,40.95 35.56,40.01 36.82,40.01 | 36.77,40.01 36.82,40.01 | 36.82,40.01 39.35,40.06 | 39.35,40.06 C1.2 | v39.37,38.73 39.37,40.05 39.35,40.06 | U3.7 47.72,24.67 v45.72,26.67
  Bottom 0.3: v45.72,26.67 39.37,33.02 39.37,36.83 v39.37,38.73
N$18  (via drill 0.35)
  Top 0.3: 44.45,44.45 Q2.2 45.72,42.85 v45.72,42.55 | v46.99,26.67 48.52,25.14 U3.8 | v46.99,38.73 C4.2
  Bottom 0.3: v46.99,26.67 v46.99,38.73 45.72,40.01 v45.72,42.55
PE
  Bottom 2.5: 2.54,22.86 2.54,8.89 3.73,7.7 X3.3 | 2.54,22.86 2.54,36.83 3.89,38.18 X4.3 | X2.3 2.62,22.94 2.54,22.86
RAW  (via drill 0.35)
  Top 0.152: 63.5,17.65 63.56,17.71 C9.A
  Top 0.5: K2.3 v31.75,22.86 | 63.56,15.24 63.56,17.71 | v62.23,15.24 63.56,15.24 | C9.A 63.5,17.91 63.5,19.05 62.23,20.32 | 62.23,20.32 61.9,20.65 U2.3 | U2.1 61.92,22.53 62.23,22.23 62.23,20.32 | SJ2.2 66.04,12.7 64.89,13.85 D7.C 63.56,13.91 63.56,15.24
  Bottom 0.5: v31.75,22.86 31.75,19.05 35.56,15.24 | 35.56,15.24 v62.23,15.24 | 35.56,15.24 29.21,8.89 19.05,8.89 17.9,7.74 SENSOR1.1 17.9,1.78 18.41,1.27 37.47,1.27 38.22,2.02 SENSOR2.1
RST  (via drill 0.35)
  Top 0.3: R4.2 38.73,34.34 38.73,27.94 40.41,26.27 U3.29 42.78,26.27 43.18,26.67 43.18,28.57 43.81,29.21 v44.45,29.21 | ISP.P$5 55.99,34.29 v52.7,34.29 52.7,33.66 48.26,29.21 v46.35,29.21 | C5.2 v49.53,38.73
  Bottom 0.3: v52.7,34.29 49.53,37.47 v49.53,38.73 | v44.45,29.21 v46.35,29.21
RX  (via drill 0.35)
  Top 0.3: U3.30 39.94,25.47 38.1,27.3 38.1,33.66 36.83,34.92 34.92,34.92 34.29,35.56 34.29,36.2 | 34.29,36.2 R3.2 | v35.56,36.2 34.29,36.2 | R11.2 66.73,24.82 67.31,25.4 v68.58,25.4 | PRG.4 56.99,45.88 57.78,45.09 61.59,45.09 v62.87,43.81 | K1.8 25.61,53.77 26.04,53.34 26.04,50.16 27.94,48.26 v34.29,48.26
  Bottom 0.3: PRG.4 56.99,44.92 56.52,44.45 46.35,44.45 45.72,44.45 45.09,44.45 44.45,45.09 44.45,46.99 43.18,48.26 v34.29,48.26 35.56,46.99 v35.56,36.2 | v68.58,25.4 68.58,27.3 64.77,31.11 63.5,31.11 62.87,31.75 v62.87,43.81
RX_SSERIAL
  Top 0.3: U3.1 42.69,22.38 40.82,20.51 40.82,20.5 40.64,20.32 40.64,17.78 41.27,17.14 44.45,17.14 45.09,17.78 U5.1
SCK  (via drill 0.35)
  Top 0.3: R10.2 v65.41,26.67 | U3.17 48.52,32.01 51.91,35.4 52.44,35.93 ISP.P$3
  Bottom 0.3: v65.41,26.67 59.69,26.67 58.21,28.15 58.21,34.61 ISP.P$3
SCL  (via drill 0.35)
  Top 0.3: U3.28 40.69,27.07 39.37,28.39 R5.1 40.59,36.25 v40.64,36.2 | K1.5 22.34,49.41 24.13,47.62 v40.01,47.62
  Bottom 0.3: v40.64,36.2 40.64,46.99 v40.01,47.62
SDA  (via drill 0.35)
  Top 0.3: U3.27 40.71,27.87 40.01,28.57 40.01,34.34 R6.1 43.12,36.25 v43.18,36.2 | K1.3 19.8,49.41 22.23,46.99 v42.55,46.99
  Bottom 0.3: v43.18,36.2 43.18,46.35 v42.55,46.99
TX  (via drill 0.35)
  Top 0.3: U3.31 39.47,24.67 37.47,26.67 37.47,33.02 36.2,34.29 32.38,34.29 31.75,34.92 R2.2 31.8,36.2 v33.02,36.2 | K1.10 28.14,53.77 28.57,53.34 28.57,50.16 v29.84,48.9
  Bottom 0.3: PRG.5 59.53,48.42 59.05,48.9 33.02,48.9 | v29.84,48.9 33.02,48.9 | v33.02,36.2 33.02,48.9
TX_SSERIAL
  Top 0.3: U3.2 43.72,21.5 43.18,20.95 41.91,20.95 41.27,20.32 U5.4
TXE_SSERIAL  (via drill 0.35)
  Top 0.3: U5.3 43.18,18.97 | 43.18,18.97 U5.2 | v65.41,15.88 66.04,16.51 R14.2 | v50.16,22.23 50.16,23.72 U3.9 | v43.18,20.32 43.18,18.97
  Bottom 0.3: v65.41,15.88 52.07,15.88 50.16,17.78 | v50.16,22.23 50.16,17.78 | 50.16,17.78 43.81,17.78 43.18,18.41 v43.18,20.32
VCC  (via drill 0.35)
  Top 0.3: 46.92,20.95 U3.6 46.92,23.56 46.54,23.94 46.54,23.95 v46.35,24.13 | U3.4 45.32,21.36 45.72,20.95 46.92,20.95 | 61.59,29.21 59.05,29.21 56.39,26.54 56.39,25.11 | 61.59,29.21 62.87,29.21 64.77,27.3 64.77,22.53 65.71,21.59 R12.2 | U5.8 45.09,15.24 45.72,15.88 50.8,15.88 51.44,16.51 v51.44,18.41 | 46.92,20.95 v51.44,20.95 51.44,24.13 52.65,25.34 C7.1 56.05,25.34 L1.2 56.39,25.11 | 36.77,37.47 R4.1 | C2.2 R6.2 R5.2 R4.1 | R4.1 R3.1 R2.1 31.06,37.41 30.48,36.83 30.48,34.92 31.75,33.66 35.56,33.66 36.2,33.02 36.2,26.04 39.37,22.86 41.91,22.86 v43.18,24.13 | U3.18 47.72,32.48 v49.53,34.29 | PRG.3 54.45,45.88 55.88,44.45 60.96,44.45 61.59,43.81 61.59,39.37 | 61.59,39.37 61.59,29.21 | ISP.P$2 60.7,38.47 61.59,39.37 | 56.39,25.11 SJ1.2
  Bottom 0.3: v51.44,18.41 v51.44,20.95 51.44,32.38 v49.53,34.29 | v43.18,24.13 v46.35,24.13
VOUT
  Top 0.3: U2.5 63.6,25.37 C8.A | L1.1 58.31,25.51 58.31,23.26 SJ1.1 | C8.A 63.63,25.91 | L1.1 58.42,25.62 | L1.1 58.2,27.09 59.69,28.57 62.23,28.57 63.63,27.18 C8.A

### Text on the board
tNames: L | L | blog.smundor.de | Simon@smundor.de | Robin@mink-stgt.de | MuMi-Humi Rev0 | 8Mhz | N | N | PE | PE | Benutzung auf / eigene Gefahr! | L | L | N | N | PE | PE | L | L | N | N | 5V | GND | A | B | 5V | GND | A | B | GND | 5V | Supply to / RasPi | PE | PE